# EasyEDA schematic SCH.json
TITLE: Sheet_1; REV: 1.0; Date: 2020-05-03; Sheet: 1/1; Drawn By: TheLight; Company: Your Company
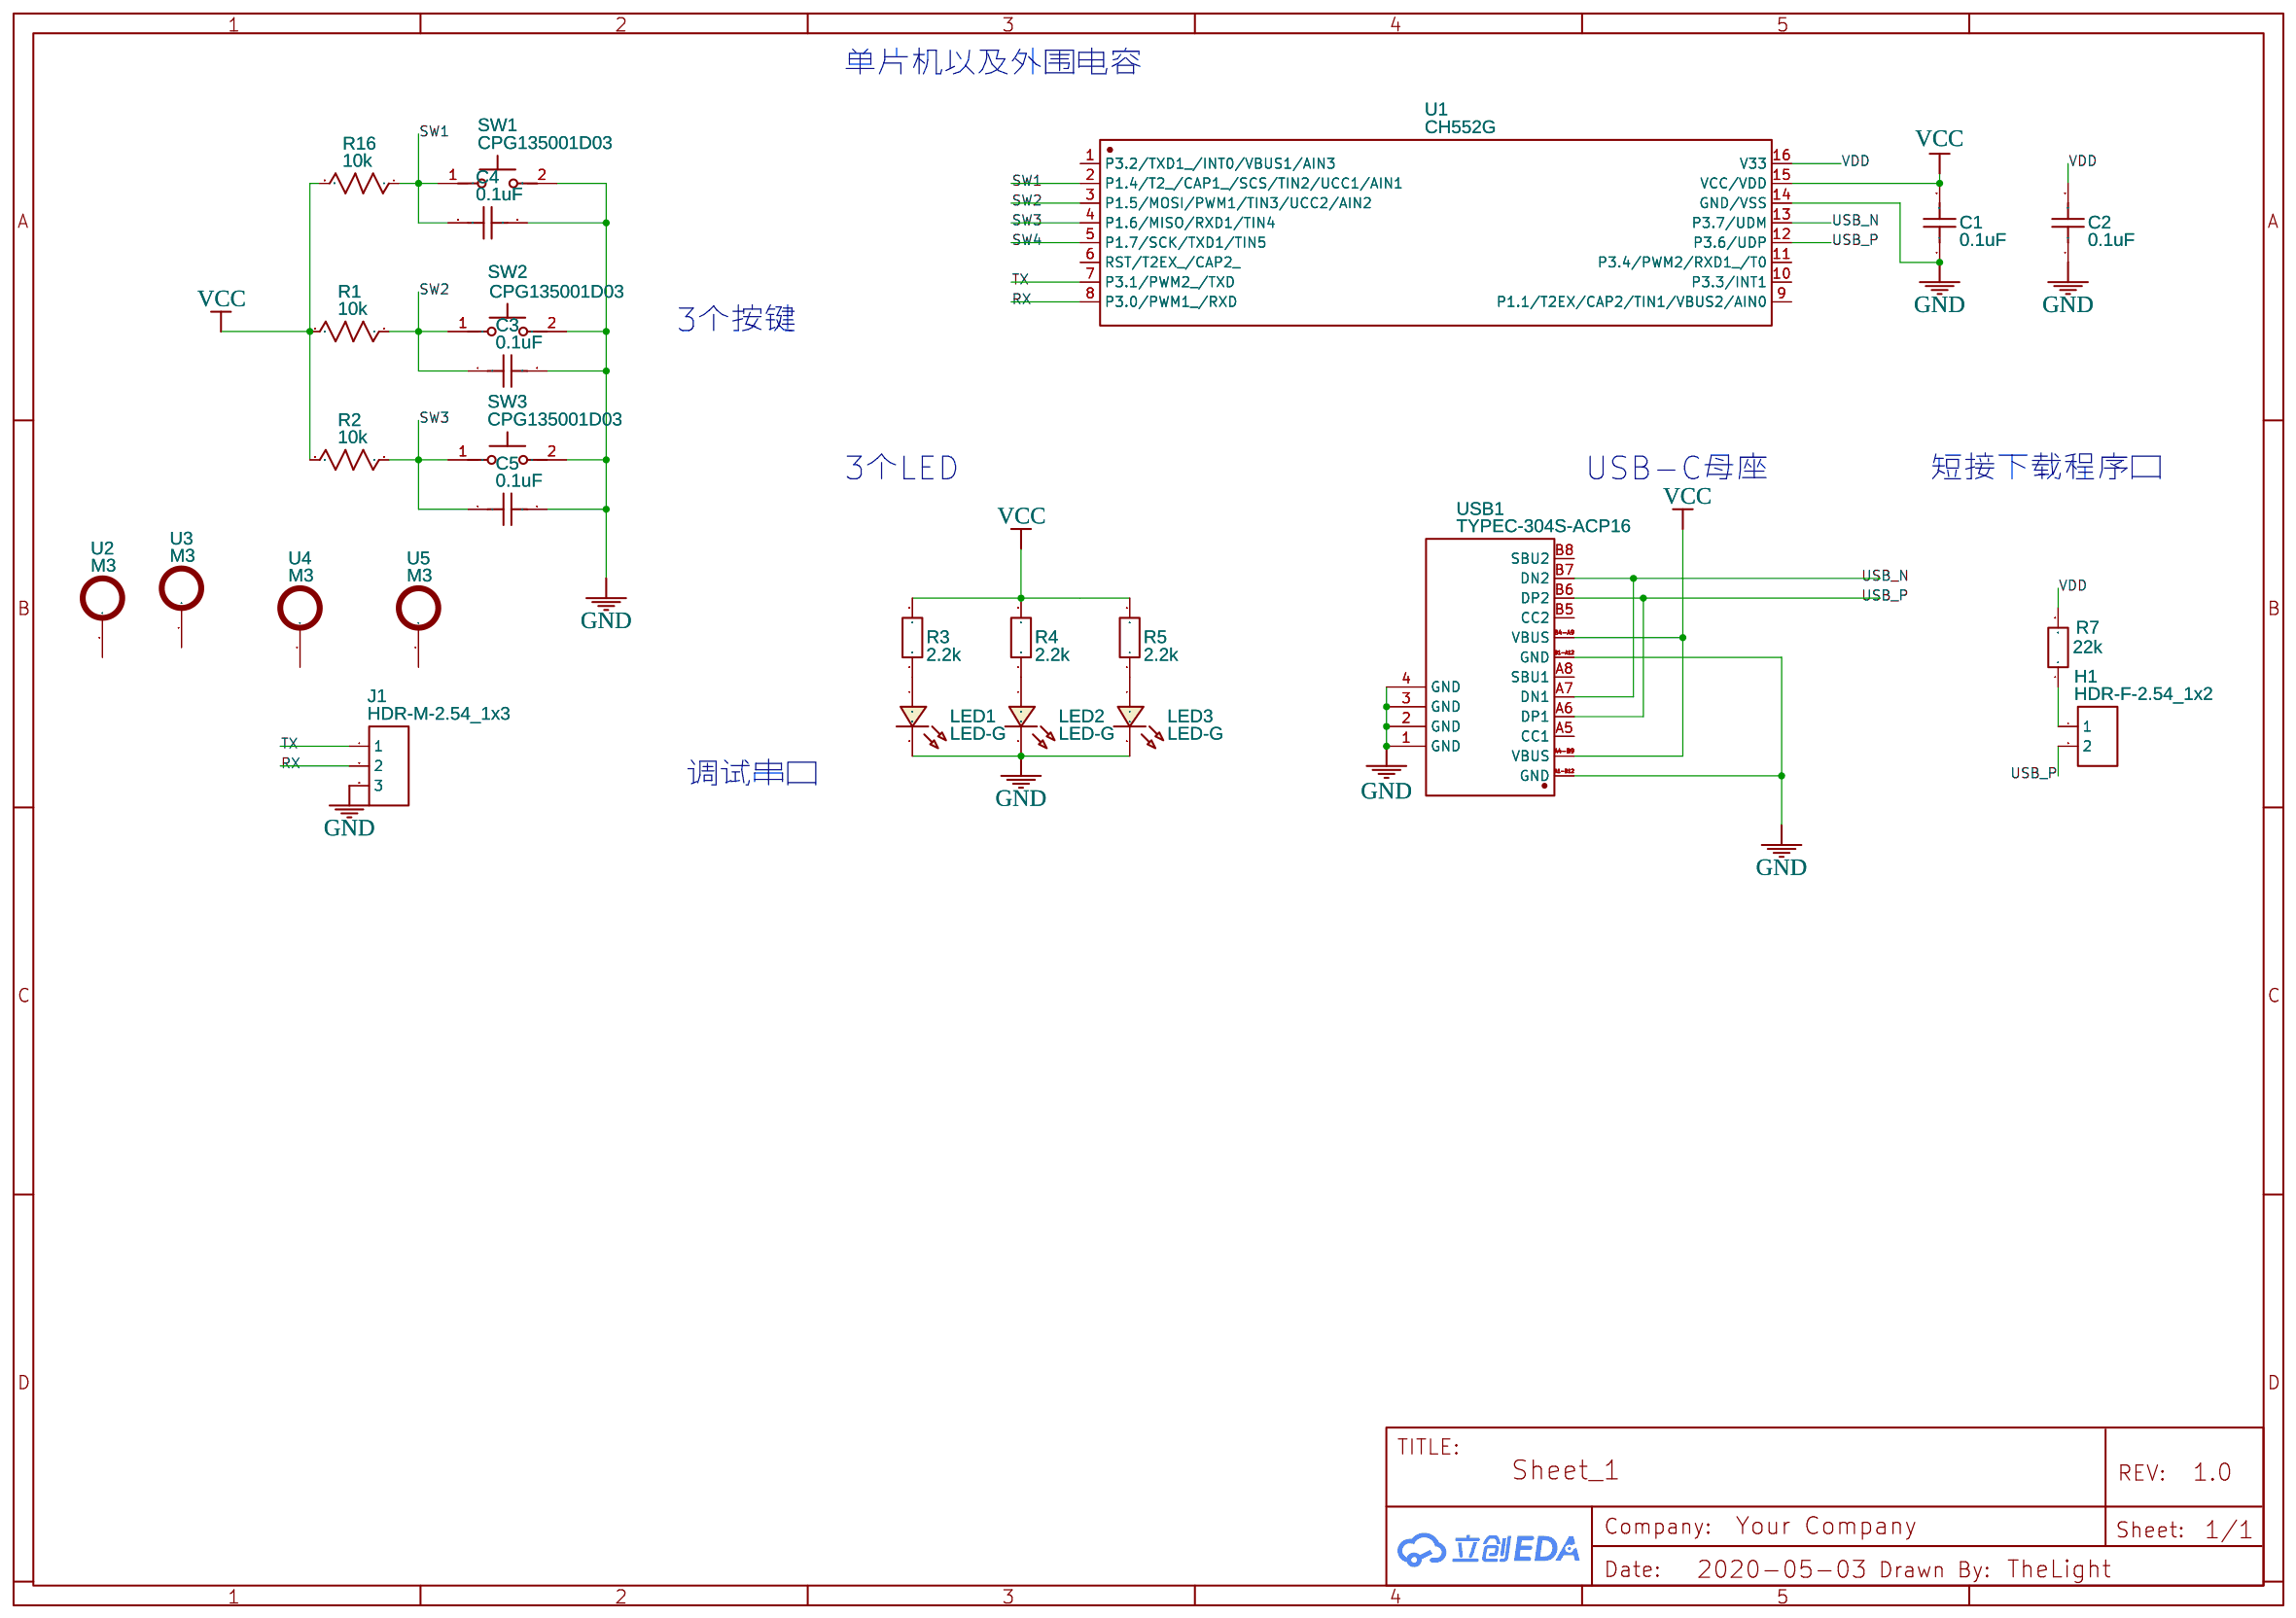
[diagram p0: schematic sheet]

## Parts
C1  0.1uF  [C0805]
C2  0.1uF  [C0805]
C3  0.1uF  [C0603]
C4  0.1uF  [C0603]
C5  0.1uF  [C0603]
H1  HDR-F-2.54_1x2  [HDR-M-2.54_1X2]
J1  HDR-M-2.54_1x3  [HDR-M-2.54_1X3]
LED1  LED-G  [LED0805_GREEN]
LED2  LED-G  [LED0805_GREEN]
LED3  LED-G  [LED0805_GREEN]
R1  10k  [R0603]
R2  10k  [R0603]
R3  2.2k  [R0805]
R4  2.2k  [R0805]
R5  2.2k  [R0805]
R7  22k  [R0805]
R16  10k  [R0603]
SW1  CPG135001D03  [KEY-TH_CPG135001D0X]
SW2  CPG135001D03  [KEY-TH_CPG135001D0X]
SW3  CPG135001D03  [KEY-TH_CPG135001D0X]
U1  CH552G  [SOP-16_L10.0-W3.9-P1.27-LS6.0-BL]
U2  M3  [M3]
U3  M3  [M3]
U4  M3  [M3]
U5  M3  [M3]
USB1  TYPEC-304S-ACP16  [USB-C-16P-S]

## Library data of the parts
C1 C2 = C_0201_US: Contributor: LCEDA_Lib
C3-C5 = 0603BB104K500NGT: Supplier: LCSC; Supplier Part: C2168571; Manufacturer: Knowles(楼氏); Contributor: LCSC; JLCPCB Part Class: Extended Part
H1 = HDR-F-2.54_1x2: Supplier Part: C49661; Supplier: LCSC; Contributor: LCEDA_Lib
J1 = HDR-M-2.54_1x3: Supplier Part: C180248; Supplier: LCSC; Contributor: LCEDA_Lib
LED1-LED3 = LED-0805_G: Manufacturer: 国星光电; Manufacturer Part: NCD0805G1; Supplier Part: C84260; Contributor: LCEDA_Lib
R1 R2 R16 = R_0603_US: Contributor: LCEDA_Lib
R3-R5 R7 = R_0201_EU: Contributor: LCEDA_Lib
SW1-SW3 = CPG135001D03: Supplier: LCSC; Supplier Part: C400231; Manufacturer: Kailh; Contributor: LCSC
U1 = CH552G: Supplier: LCSC; Manufacturer: WCH; Supplier Part: C111292; LCSC Assembly: Yes; SMT Type: Extend
U2-U5 = M3: Contributor: dong464731411
USB1 = TYPEC-304S-ACP16: Supplier: LCSC; Supplier Part: C720630; Manufacturer: XUNPU; Contributor: LCSC; JLCPCB Part Class: Extended Part

## Nets
GND: C1.1 C2.1 C3.2 C4.2 C5.2 J1.3 LED1.2 LED2.2 LED3.2 SW1.2 SW2.2 SW3.2 U1.14(GND/VSS) USB1.1(GND) USB1.2(GND) USB1.3(GND) USB1.4(GND) USB1.A1-B12(GND) USB1.B1-A12(GND)
VCC: C1.2 R1.2 R2.2 R3.2 R4.2 R5.2 R16.2 U1.15(VCC/VDD) USB1.A4-B9(VBUS) USB1.B4-A9(VBUS)
VDD: C2.2 R7.2 U1.16(V33)
RX: J1.2 U1.8(P3.0/PWM1_/RXD)
SW1: C4.1 R16.1 SW1.1 U1.2(P1.4/T2_/CAP1_/SCS/TIN2/UCC1/AIN1)
SW2: C3.1 R1.1 SW2.1 U1.3(P1.5/MOSI/PWM1/TIN3/UCC2/AIN2)
SW3: C5.1 R2.1 SW3.1 U1.4(P1.6/MISO/RXD1/TIN4)
SW4: U1.5(P1.7/SCK/TXD1/TIN5)
TX: J1.1 U1.7(P3.1/PWM2_/TXD)
USB_N: U1.13(P3.7/UDM) USB1.A7(DN1) USB1.B7(DN2)
USB_P: H1.2 U1.12(P3.6/UDP) USB1.A6(DP1) USB1.B6(DP2)
Net-(H1-1): H1.1 R7.1
Net-(LED1-1): LED1.1 R3.1
Net-(LED2-1): LED2.1 R4.1
Net-(LED3-1): LED3.1 R5.1

Not connected (* = marked no-connect by the designer): U1 1(P3.2/TXD1_/INT0/VBUS1/AIN3) 6(RST/T2EX_/CAP2_) 9(P1.1/T2EX/CAP2/TIN1/VBUS2/AIN0) 10(P3.3/INT1) 11(P3.4/PWM2/RXD1_/T0); U2 1; U3 1; U4 1; U5 1; USB1 A5(CC1) A8(SBU1) B5(CC2) B8(SBU2)

## Notes on the sheet
- 单片机以及外围电容
- 3个按键
- 3个LED
- USB-C母座
- 短接下载程序口
- 调试串口
